# Altium schematic sheet PSU.SchDoc
size Letter
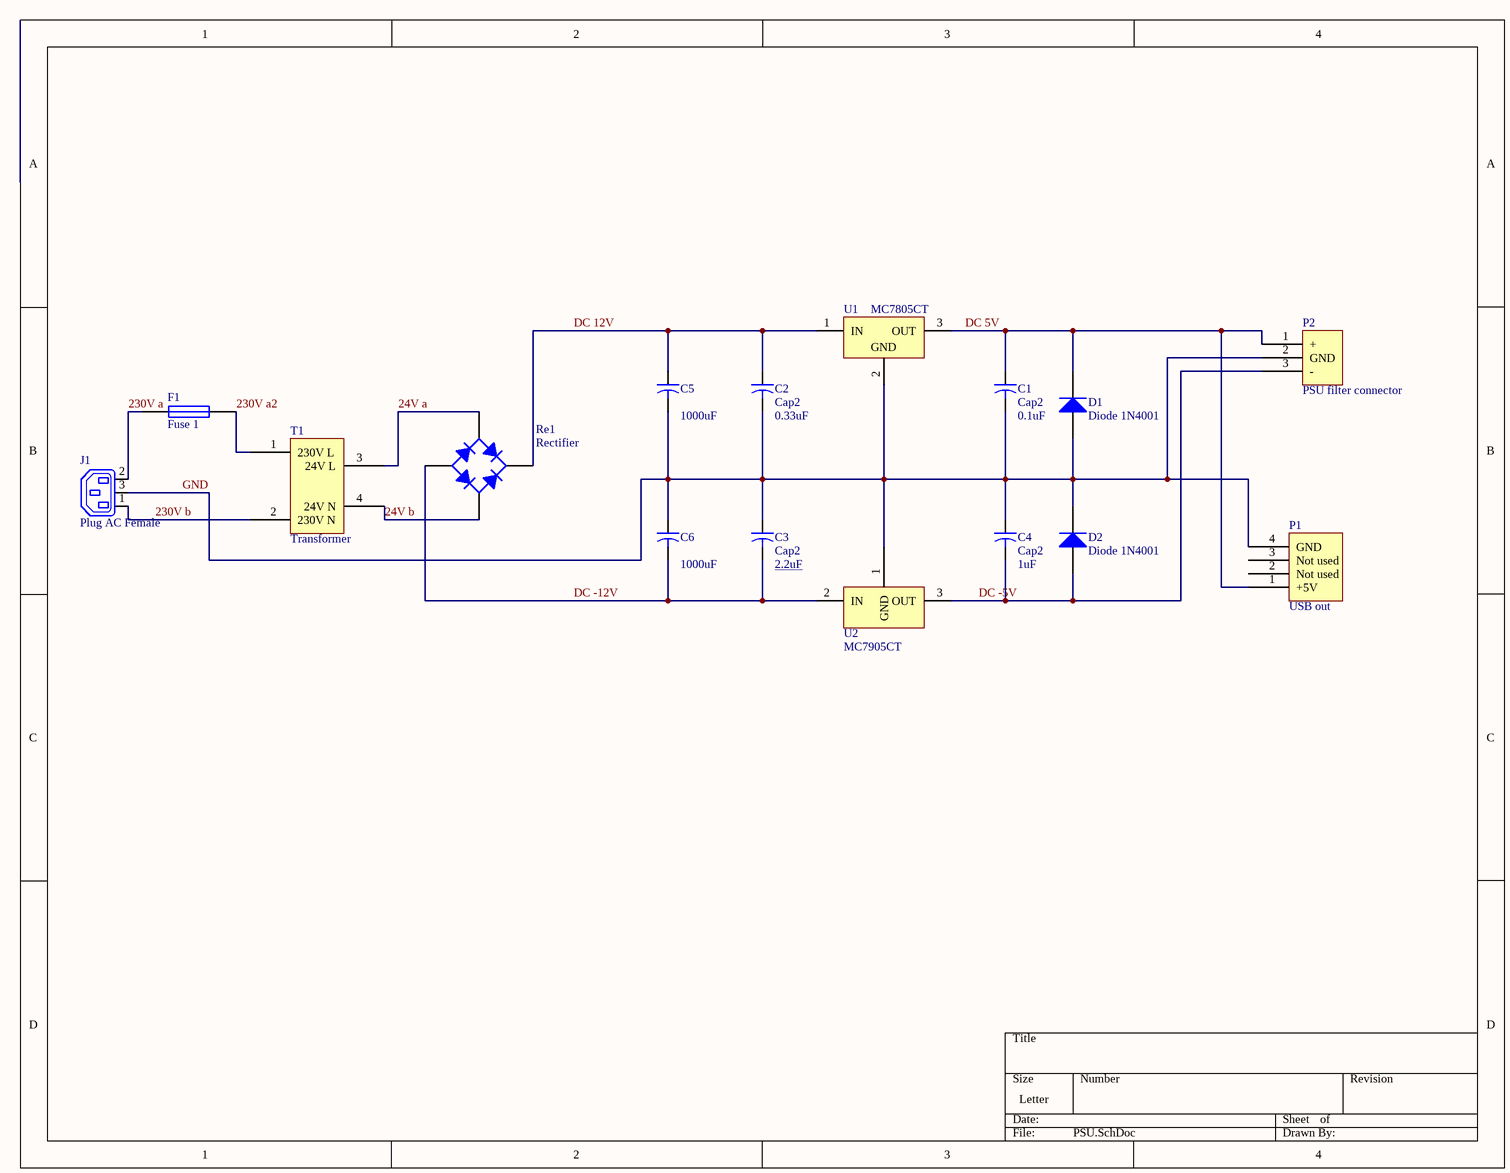
[diagram p0: PSU.SchDoc]

## Parts
C1  Cap2  value 0.1uF  [Cap Jamicon 1uF]
C2  Cap2  value 0.33uF  [Cap Jamicon 330nF]
C3  Cap2  value 2.2uF  [Cap Panasonic 2.2uF]
C4  Cap2  value 1uF  [Cap Jamicon 1uF]
C5  value 1000uF  [Cap 1000uF]
C6  value 1000uF  [Cap 1000uF]
D1  Diode 1N4001  [DO-41]
D2  Diode 1N4001  [DO-41]
F1  Fuse 1  [Fuse 22mm]
J1  Plug AC Female  [Power input PSU]
P1  USB out  [USB out]
P2  PSU filter connector  [PSU filter connector]
Re1  Rectifier  [Rectifier PSU]
T1  Transformer  [Transformator]
U1  MC7805CT  [221A-06]
U2  MC7905CT  [221A-09]

## Nets
24V a: Re1.4(C) T1.3(24V_L)
24V b: Re1.2(C) T1.4(24V_N)
230V a: F1.1 J1.2(N)
230V a2: F1.2 T1.1(230V_L)
230V b: J1.1(L) T1.2(230V_N)
DC 5V: C1.1 D1.2(K) P1.1(+5V) P2.1(+) U1.3(OUT)
DC 12V: C2.1 C5.1 Re1.1(K) U1.1(IN)
DC -5V: C4.2 D2.1(A) P2.3(-) U2.3(OUT)
DC -12V: C3.2 C6.2 Re1.3(A) U2.2(IN)
GND: C1.2 C2.2 C3.1 C4.1 C5.2 C6.1 D1.1(A) D2.2(K) J1.3(E) P1.4(GND) P2.2(GND) U1.2(GND) U2.1(GND)

Not connected (* = marked no-connect by the designer): P1 2(Not_used) 3(Not_used)

## Library data of the parts
C1-C4 = Cap2: Capacitor; Published: 23-Sep-2002; PackageReference: CAPR5-4X5; Publisher: Altium Limited; PackageDescription: Capacitor; 2 Leads
C5 C6 = Cap2: Cap; Published: 23-Sep-2002; PackageReference: CAPR5-4X5; Publisher: Altium Limited; PackageDescription: Capacitor; 2 Leads
D1 D2 = Diode 1N4001: 1 Amp General Purpose Rectifier; Published: 8-Jun-2000; LatestRevisionDate: 17-Jul-2002; LatestRevisionNote: Re-released for DXP Platform.; DatasheetVersion: 1998; PackageVersion: Aug-1999; PackageReference: DO-41; Publisher: Altium Limited; PackageDescription: Diode, Axial; Body 5.2 x 2.7 mm (LxDia. max), Lead Dia. 0.86 mm (max); Code_JEDEC: DO-204-AL; ComponentLink1Description: Manufacturer Link; ComponentLink1URL: http://www.fairchildsemi.com/; ComponentLink2Description: Datasheet; ComponentLink2URL: http://www.fairchildsemi.com/ds/1N%2F1N4001.pdf
F1 = Fuse 1: Fuse; Published: 8-Jun-2000; LatestRevisionDate: 17-Jul-2002; LatestRevisionNote: Re-released for DXP Platform.; PackageReference: PIN-W2/E2.8; Publisher: Altium Limited; PackageDescription: Thru-Hole; 2 Leads
J1 = Plug AC Female: IEC Mains Power Outlet, EN60 320-2-2 F Class I, PC Flange Rear Mount, Chassis Socket; PackageDocument: ver.80, 15-Sep-2003; MaximumRating: 10A, 250V a.c. (UL & CSA 15A, 250V a.c.); MountingFixtures: Not drawn on schematic symbol.; PCB_Layout: Complies with manufacturer's recommendation.; DrillSize: Corresponds to nominal value.; Published: 15-Jul-2004; LatestRevisionDate: 15-Jul-2004; LatestRevisionNote: Component Replaced & renamed from "Phonejack".; DatasheetDocument: ver.80, 15-Sep-2003; PackageReference: PX0675/PC; Publisher: Altium Limited; Terminations: P.C. Spills; ComponentLink1Description: Manufacturer Link; ComponentLink1URL: http://www.bulgin.co.uk/
Re1 = Bridge1 Resonator PSU: Full Wave Diode Bridge; Published: 8-Jun-2000; LatestRevisionDate: 29-May-2009; LatestRevisionNote: Sch pins A & K swapped.; DatasheetVersion: E2732B; PackageReference: D-38; Publisher: Altium Limited; PackageDescription: Bridge Rectifier; 4 Terminals; Body 9.4 x 9.4 mm (typ); Pitch 5.08 mm
U1 = MC7805CT: Three-Terminal Positive Voltage Regulator; Note: Heatsink surface is connected to Pin 2; Published: 15-Apr-2002; DatasheetVersion: 1997; PackageVersion: 1997; PackageReference: 221A-06; Publisher: Altium Limited; PackageDescription: TO, Thru-Hole, Vertical, Heatsink Mounted; 3 In-Line Leads; Pitch 2.54 mm; Code_JEDEC: TO-262-AA; ComponentLink1Description: Manufacturer Link; ComponentLink1URL: http://www.onsemi.com/site/products/taxonomy/0,4438,503,00.html; ComponentLink2Description: Datasheet; ComponentLink2URL: http://www.onsemi.com/pub/Collateral/MC7800-D.PDF
U2 = MC7905CT: Three-Terminal Negative Voltage Regulator; Note: Heatsink surface connected to Pin 2; Published: 15-Apr-2002; DatasheetVersion: 1996; PackageReference: 221A-09; Publisher: Altium Limited; PackageDescription: TO, Thru-Hole, Vertical, Heatsink Mounted; 3 In-Line Leads; Pitch 2.54 mm; Code_JEDEC: TO-262-AA; ComponentLink1Description: Manufacturer Link; ComponentLink1URL: http://www.onsemi.com/site/products/taxonomy/0,4438,503,00.html; ComponentLink2Description: Datasheet; ComponentLink2URL: http://www.onsemi.com/pub/Collateral/MC7900-D.PDF